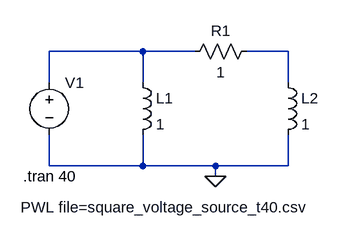
[diagram p0: schematic inductor_realization.asc]
inductor_realization.asc, the LTspice schematic file:
Version 4.1
SHEET 1 880 680
WIRE 224 80 80 80
WIRE 304 80 224 80
WIRE 448 80 384 80
WIRE 80 128 80 80
WIRE 224 128 224 80
WIRE 448 128 448 80
WIRE 80 256 80 208
WIRE 224 256 224 208
WIRE 224 256 80 256
WIRE 336 256 224 256
WIRE 448 256 448 208
WIRE 448 256 336 256
WIRE 336 272 336 256
FLAG 336 272 0
SYMBOL voltage 80 112 R0
WINDOW 3 -44 208 Left 2
WINDOW 123 0 0 Left 0
WINDOW 39 0 0 Left 0
SYMATTR InstName V1
SYMATTR Value PWL file=square_voltage_source_t40.csv
SYMBOL ind 208 112 R0
SYMATTR InstName L1
SYMATTR Value 1
SYMBOL res 288 96 R270
WINDOW 0 32 56 VTop 2
WINDOW 3 0 56 VBottom 2
SYMATTR InstName R1
SYMATTR Value 1
SYMBOL ind 432 112 R0
SYMATTR InstName L2
SYMATTR Value 1
TEXT 40 272 Left 2 !.tran 40

The netlist it stands for:
* inductor_realization.asc
V1 N001 0 PWL file=square_voltage_source_t40.csv
L1 N001 0 1
R1 N001 N002 1
L2 N002 0 1
.tran 40
.backanno
.end